# EAGLE schematic mrShark 04.a (EAGLE 6.1)
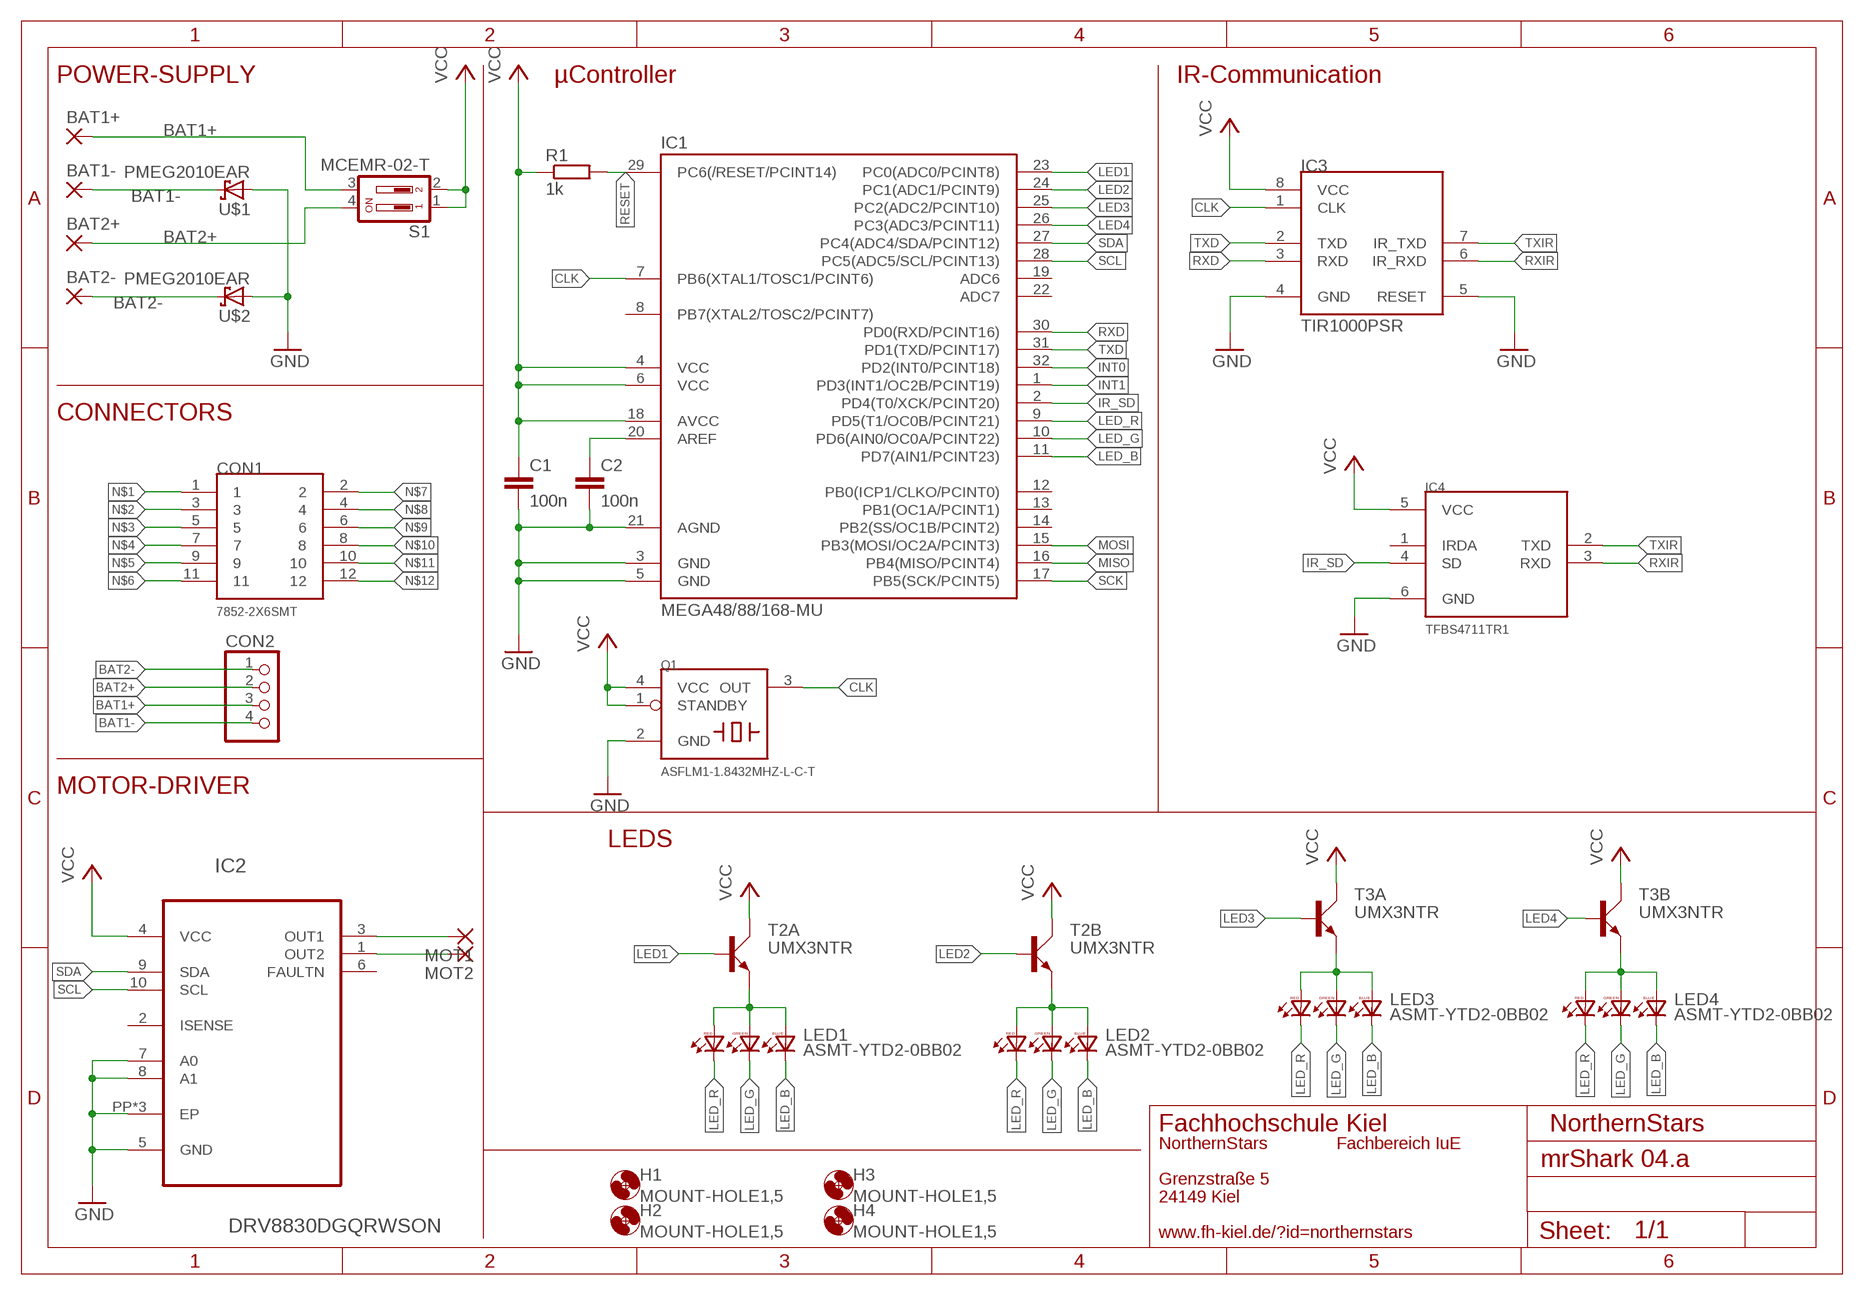
[diagram p0: schematic, sheet 1]

## Parts
BAT1+  1,6/0,9  [1,6/0,9]
BAT1-  1,6/0,9  [1,6/0,9]
BAT2+  1,6/0,9  [1,6/0,9]
BAT2-  1,6/0,9  [1,6/0,9]
C1  100n  C-EUC0201  [C0201]
C2  100n  C-EUC0201  [C0201]
CON1  7852-2X6SMT  [7852-2X6]
CON2  PINHD-1X04_2.54-SMD-90°  [1X04SMD/90]
H1  MOUNT-HOLE1,5  [1,5]
H2  MOUNT-HOLE1,5  [1,5]
H3  MOUNT-HOLE1,5  [1,5]
H4  MOUNT-HOLE1,5  [1,5]
IC1  MEGA48/88/168-MU  [MLF32]
IC2  DRV8830DGQRWSON  [S-PDSO-N10]
IC3  TIR1000PSR  [SO-08]
IC4  TFBS4711TR1  [TFBS4711]
LED1  ASMT-YTD2-0BB02  PLCC6  [PLCC6]
LED2  ASMT-YTD2-0BB02  PLCC6  [PLCC6]
LED3  ASMT-YTD2-0BB02  PLCC6  [PLCC6]
LED4  ASMT-YTD2-0BB02  PLCC6  [PLCC6]
MOT1  1,6/0,9  [1,6/0,9]
MOT2  1,6/0,9  [1,6/0,9]
Q1  ASFLM1-1.8432MHZ-L-C-T  MEMS'-SMD  [MEMS]
R1  1k  R-EU_R0201  [R0201]
S1  MCEMR-02-T  219-02  [CTS-219-02]
T2  UMX3NTR  UMX3NTR-SOT363  [SOT363_INFINEON]
T3  UMX3NTR  UMX3NTR-SOT363  [SOT363_INFINEON]
U$1  PMEG2010EAR  [SOD323-R]
U$2  PMEG2010EAR  [SOD323-R]

## Nets
BAT1+: BAT1+.1(P) CON2.3 S1.3
BAT1-: BAT1-.1(P) CON2.4 U$1.C
BAT2+: BAT2+.1(P) CON2.2 S1.4
BAT2-: BAT2-.1(P) CON2.1 U$2.C
CLK: IC1.7(PB6(XTAL1/TOSC1/PCINT6)) IC3.1(CLK) Q1.3(OUT)
GND: C1.2 C2.2 IC1.3(GND) IC1.5(GND) IC1.21(AGND) IC2.5(GND) IC2.7(A0) IC2.8(A1) IC2.PP(EP) IC2.PP@1(EP) IC2.PP@2(EP) IC3.4(GND) IC3.5(RESET) IC4.6(GND) Q1.2(GND) U$1.A U$2.A
INT0: IC1.32(PD2(INT0/PCINT18))
INT1: IC1.1(PD3(INT1/OC2B/PCINT19))
IR_SD: IC1.2(PD4(T0/XCK/PCINT20)) IC4.4(SD)
LED1: IC1.23(PC0(ADC0/PCINT8)) T2.2(A:B)
LED1+: LED1.4(RA) LED1.5(GA) LED1.6(BA) T2.1(A:E)
LED2: IC1.24(PC1(ADC1/PCINT9)) T2.3(B:B)
LED2+: LED2.4(RA) LED2.5(GA) LED2.6(BA) T2.5(B:E)
LED3: IC1.25(PC2(ADC2/PCINT10)) T3.2(A:B)
LED3+: LED3.4(RA) LED3.5(GA) LED3.6(BA) T3.1(A:E)
LED4: IC1.26(PC3(ADC3/PCINT11)) T3.3(B:B)
LED4+: LED4.4(RA) LED4.5(GA) LED4.6(BA) T3.5(B:E)
LED_B: IC1.11(PD7(AIN1/PCINT23)) LED1.1(BC) LED2.1(BC) LED3.1(BC) LED4.1(BC)
LED_G: IC1.10(PD6(AIN0/OC0A/PCINT22)) LED1.2(GC) LED2.2(GC) LED3.2(GC) LED4.2(GC)
LED_R: IC1.9(PD5(T1/OC0B/PCINT21)) LED1.3(RC) LED2.3(RC) LED3.3(RC) LED4.3(RC)
MISO: IC1.16(PB4(MISO/PCINT4))
MOSI: IC1.15(PB3(MOSI/OC2A/PCINT3))
N$1: CON1.1
N$2: CON1.3
N$3: CON1.5
N$4: CON1.7
N$5: CON1.9
N$6: CON1.11
N$7: CON1.2
N$8: CON1.4
N$9: CON1.6
N$10: CON1.8
N$11: CON1.10
N$12: CON1.12
N$14: C2.1 IC1.20(AREF)
N$15: IC2.3(OUT1) MOT1.1(P)
N$16: IC2.1(OUT2) MOT2.1(P)
RESET: IC1.29(PC6(/RESET/PCINT14)) R1.2
RXD: IC1.30(PD0(RXD/PCINT16)) IC3.3(RXD)
RXIR: IC3.6(IR_RXD) IC4.3(RXD)
SCK: IC1.17(PB5(SCK/PCINT5))
SCL: IC1.28(PC5(ADC5/SCL/PCINT13)) IC2.10(SCL)
SDA: IC1.27(PC4(ADC4/SDA/PCINT12)) IC2.9(SDA)
TXD: IC1.31(PD1(TXD/PCINT17)) IC3.2(TXD)
TXIR: IC3.7(IR_TXD) IC4.2(TXD)
VCC: C1.1 IC1.4(VCC) IC1.6(VCC) IC1.18(AVCC) IC2.4(VCC) IC3.8(VCC) IC4.5(VCC) Q1.1(STANDBY) Q1.4(VCC) R1.1 S1.1 S1.2 T2.4(B:C) T2.6(A:C) T3.4(B:C) T3.6(A:C)
Unconnected: IC1.8(PB7(XTAL2/TOSC2/PCINT7)) IC1.12(PB0(ICP1/CLKO/PCINT0)) IC1.13(PB1(OC1A/PCINT1)) IC1.14(PB2(SS/OC1B/PCINT2)) IC1.19(ADC6) IC1.22(ADC7) IC2.2(ISENSE) IC2.6(FAULTN) IC4.1(IRDA)

## Notes on the sheet
- POWER-SUPPLY | µController | IR-Communication
- CONNECTORS
- MOTOR-DRIVER
- LEDS
- Fachhochschule Kiel | NorthernStars
- NorthernStars | Fachbereich IuE
- Grenzstraße 5
- 24149 Kiel
- www.fh-kiel.de/?id=northernstars

## Library data of the parts
BAT1+ BAT1- BAT2+ BAT2- MOT1 MOT2 = wirepad:1,6/0,9: THROUGH-HOLE PAD
C1 C2 = rcl:C-EU: CAPACITOR, European symbol
CON1 = w+p:7852-2X6: W+P SMT Header 0.80x1.20mm Pitch, Vertical, Double Row, W/o loc. pegs RM 0.8mm http://www.wppro.com <http://wppro.com/content/de/produkte/buchsenleisten/raster-08mm/product/7852.html>; CONTACTS: 12; LOC_PEGS: 00; PACKAGING: FST; PLATING: 00; SERIENS: 7852
CON2 = pinhead-2:PINHD-1X04: PIN HEADER
H1-H4 = holes:MOUNT-HOLE: MOUNTING HOLE with drill center marker
IC1 = avr-6:MEGA48/88/168
IC2 = texas:DRV8830DGQR: LOW-VOLTAGE MOTOR DRIVER WITH SERIAL INTERFACE
IC3 = texas:TIR1000: Texas Instruments TIR1000 STANDALONE IrDATM ENCODER AND DECODER
IC4 = vishay:TFBS4711: TRANSCEIVER IRDA Vishay TFBS4711-TR1 Infrared Transciever 900nm, 600µA, 1m range
LED1-LED4 = led:PLCC6: Standart PLCC6 Package RGB LED
Q1 = crystal:MEMS: ASFLM crystal resonator 5.0x3.2mm http://www.abracon.com/Oscillators/ASFLM.pdf
R1 = rcl:R-EU_: RESISTOR, European symbol
S1 = switch-dil:219-02*: Surface Mount DIP Switch Series 219 SMT CTS Electronic Components Sourc: www.ctscorp.com
T2 T3 = transistor-small-signal:UMX3NTR: DUAL NPN Transistor UMX3NTR Uce = 50V Ic = 150mA Pd = 150mW
U$1 U$2 = diode:PMEG2010EA: NXP - Low V F (MEGA) Schottky barrier diode If = 1A, Vr = 20V http://www.farnell.com/datasheets/687996.pdf